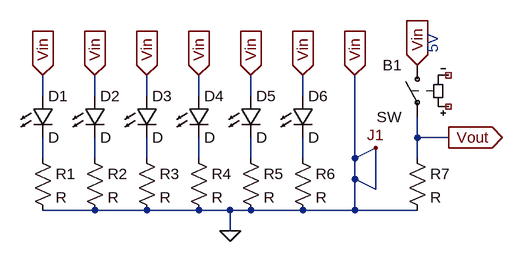
[diagram p0: schematic Draft1.asc]
Draft1.asc, the LTspice schematic file:
Version 4
SHEET 1 880 680
WIRE -416 48 -416 16
WIRE -336 48 -336 16
WIRE -256 48 -256 16
WIRE -176 48 -176 16
WIRE -96 48 -96 16
WIRE -16 48 -16 16
WIRE 160 112 160 80
WIRE 208 112 160 112
WIRE -416 144 -416 112
WIRE -336 144 -336 112
WIRE -256 144 -256 112
WIRE -176 144 -176 112
WIRE -96 144 -96 112
WIRE -16 144 -16 112
WIRE 64 144 64 16
WIRE 64 144 96 128
WIRE 160 144 160 112
WIRE 64 176 64 144
WIRE 96 192 96 128
WIRE 96 192 64 176
WIRE -336 224 -416 224
WIRE -256 224 -336 224
WIRE -176 224 -256 224
WIRE -128 224 -176 224
WIRE -96 224 -128 224
WIRE -16 224 -96 224
WIRE 64 224 64 176
WIRE 64 224 -16 224
WIRE 160 224 64 224
WIRE -128 256 -128 224
FLAG 96 128 J1
FLAG 208 112 Vout
IOPIN 208 112 Out
FLAG -416 16 Vin
IOPIN -416 16 In
FLAG -336 16 Vin
IOPIN -336 16 In
FLAG -256 16 Vin
IOPIN -256 16 In
FLAG -176 16 Vin
IOPIN -176 16 In
FLAG -96 16 Vin
IOPIN -96 16 In
FLAG -16 16 Vin
IOPIN -16 16 In
FLAG 64 16 Vin
IOPIN 64 16 In
FLAG 160 0 Vin
IOPIN 160 0 In
FLAG -128 256 0
SYMBOL res -432 128 R0
SYMATTR InstName R1
SYMBOL res -352 128 R0
SYMATTR InstName R2
SYMBOL res -272 128 R0
SYMATTR InstName R3
SYMBOL res -192 128 R0
SYMATTR InstName R4
SYMBOL res -112 128 R0
SYMATTR InstName R5
SYMBOL res -32 128 R0
SYMATTR InstName R6
SYMBOL LED -352 48 R0
SYMATTR InstName D2
SYMBOL LED -272 48 R0
SYMATTR InstName D3
SYMBOL LED -192 48 R0
SYMATTR InstName D4
SYMBOL LED -112 48 R0
SYMATTR InstName D5
SYMBOL LED -32 48 R0
SYMATTR InstName D6
SYMBOL res 144 128 R0
SYMATTR InstName R7
SYMBOL sw 160 -16 M0
SYMATTR InstName B1
SYMATTR Prefix ""
SYMBOL LED -432 48 R0
SYMATTR InstName D1
TEXT 184 -48 VRight 2 ;5V

The netlist it stands for:
* Draft1.asc
R1 N001 0 R
R2 N002 0 R
R3 N003 0 R
R4 N004 0 R
R5 N005 0 R
R6 N006 0 R
D2 0 N002 D
D3 0 N003 D
D4 0 N004 D
D5 0 N005 D
D6 0 N006 D
R7 Vout 0 R
XB1 0 Vout NC_01 NC_02 SW  ; pins A B NC+ NC-
D1 0 N001 D
.model D D
.lib standard.dio
* 5V
.backanno
.end